# EAGLE schematic LiPo charger (EAGLE 7.7.0)
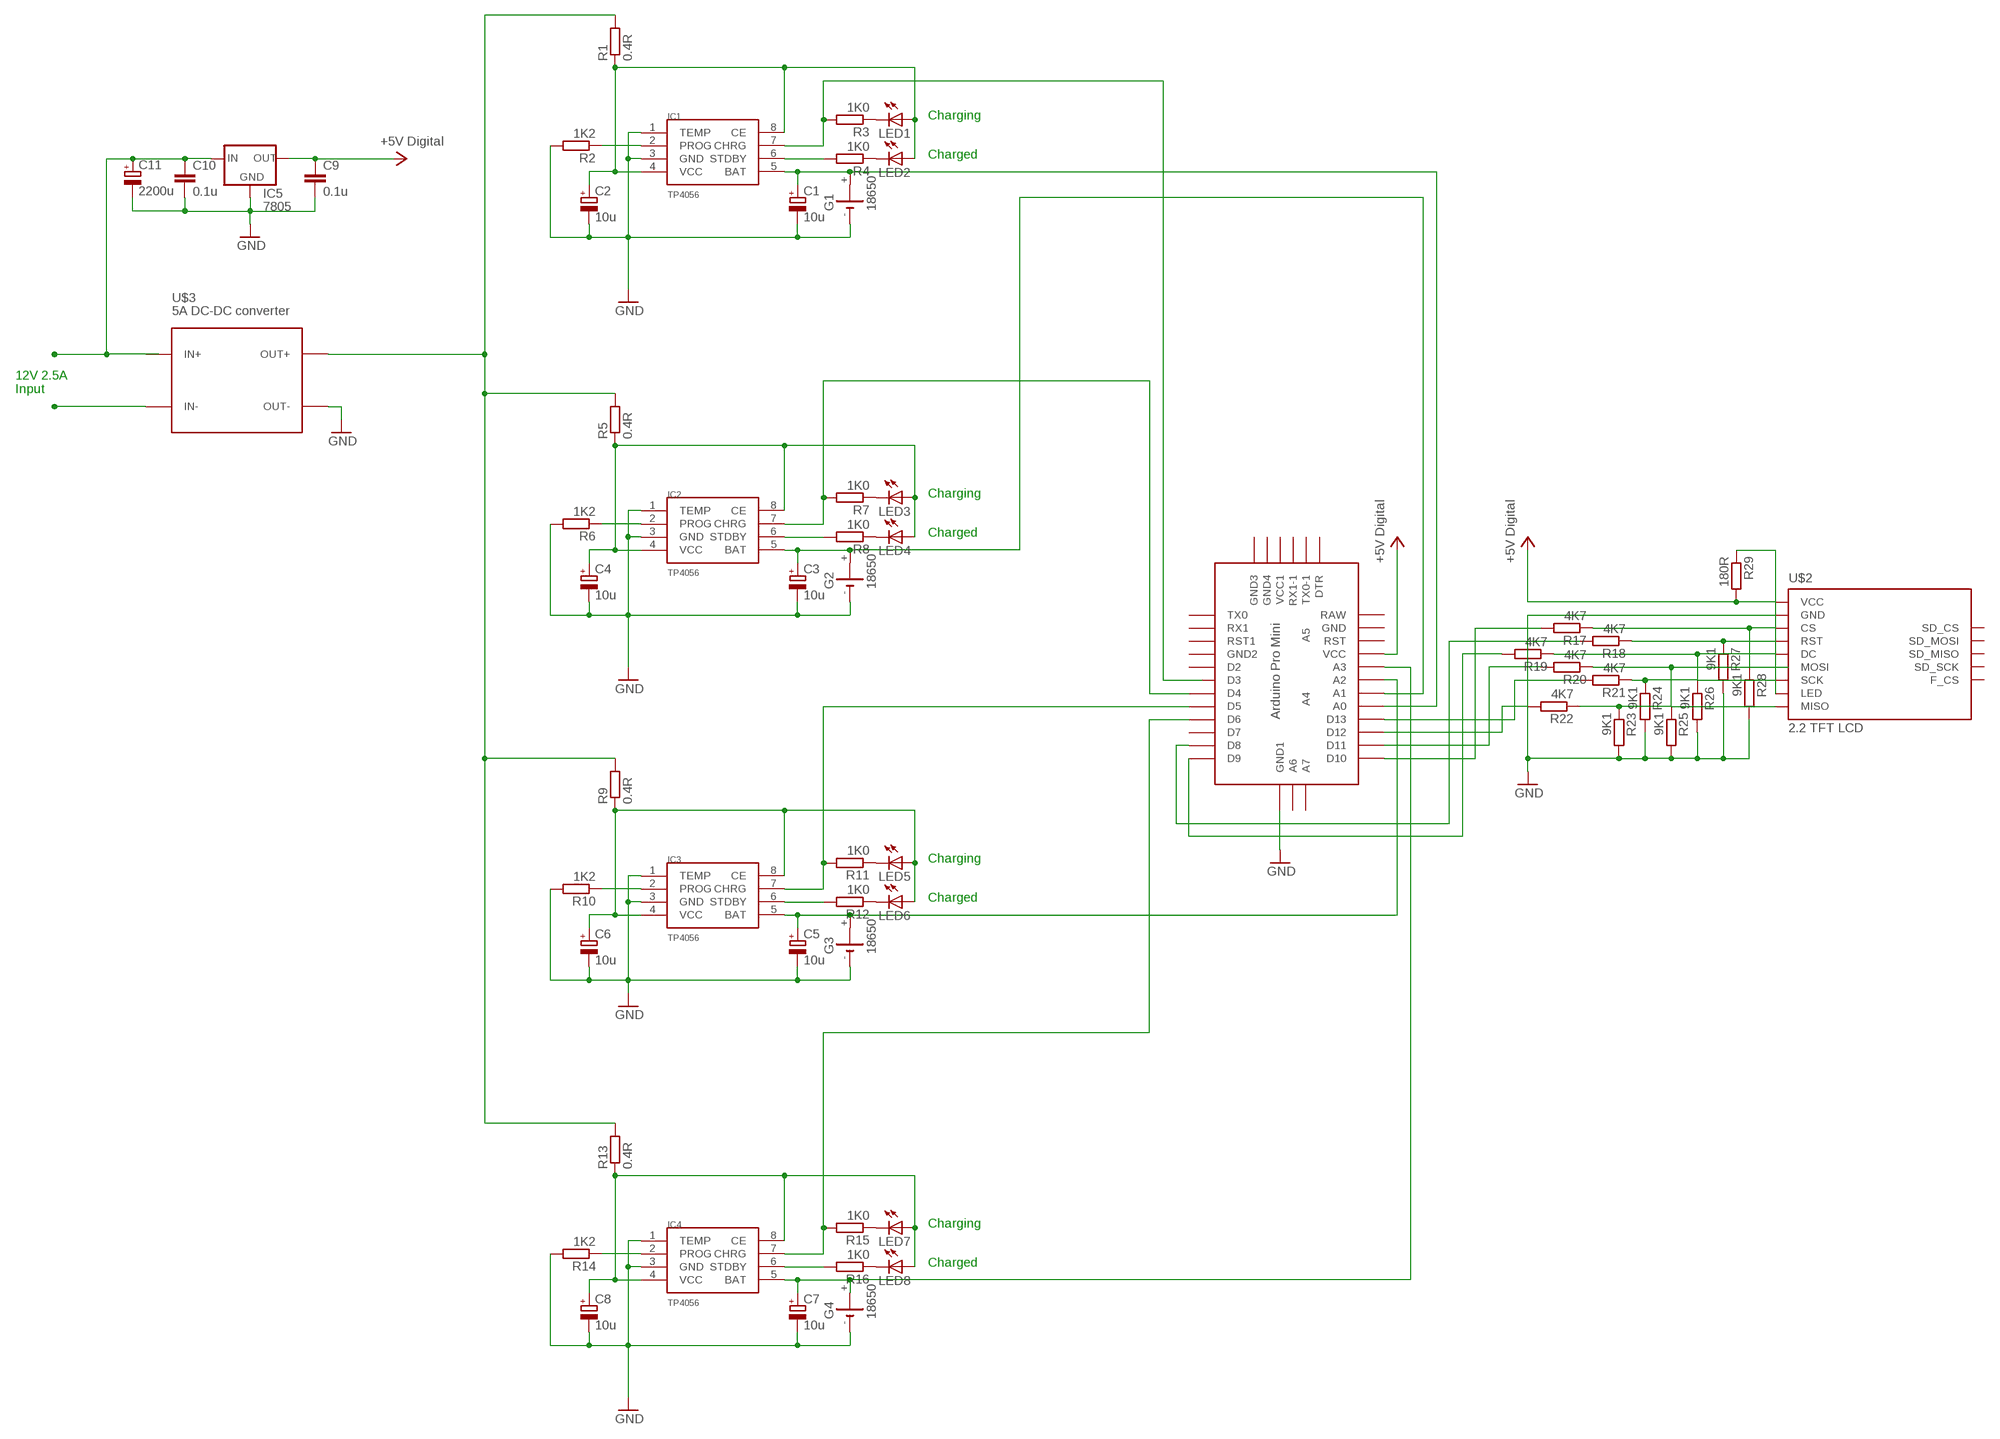
[diagram p0: schematic, sheet 1]

## Parts
C1  10u  CPOL-EU153CLV-1010  [153CLV-1010]
C2  10u  CPOL-EU153CLV-1010  [153CLV-1010]
C3  10u  CPOL-EU153CLV-1010  [153CLV-1010]
C4  10u  CPOL-EU153CLV-1010  [153CLV-1010]
C5  10u  CPOL-EU153CLV-1010  [153CLV-1010]
C6  10u  CPOL-EU153CLV-1010  [153CLV-1010]
C7  10u  CPOL-EU153CLV-1010  [153CLV-1010]
C8  10u  CPOL-EU153CLV-1010  [153CLV-1010]
C9  0.1u  C-EU050-025X075  [C050-025X075]
C10  0.1u  C-EU050-025X075  [C050-025X075]
C11  2200u  CPOL-EU153CLV-1010  [153CLV-1010]
G1  18650  CR2032V  [CR2032V]
G2  18650  CR2032V  [CR2032V]
G3  18650  CR2032V  [CR2032V]
G4  18650  CR2032V  [CR2032V]
IC1  TP4056  [SOP-8]
IC2  TP4056  [SOP-8]
IC3  TP4056  [SOP-8]
IC4  TP4056  [SOP-8]
IC5  7805  78XXL  [78XXL]
LED1  CREE-XLAMP-XM-L  [CREE-XLAMP-XM-L]
LED2  CREE-XLAMP-XM-L  [CREE-XLAMP-XM-L]
LED3  CREE-XLAMP-XM-L  [CREE-XLAMP-XM-L]
LED4  CREE-XLAMP-XM-L  [CREE-XLAMP-XM-L]
LED5  CREE-XLAMP-XM-L  [CREE-XLAMP-XM-L]
LED6  CREE-XLAMP-XM-L  [CREE-XLAMP-XM-L]
LED7  CREE-XLAMP-XM-L  [CREE-XLAMP-XM-L]
LED8  CREE-XLAMP-XM-L  [CREE-XLAMP-XM-L]
R1  0.4R  R-EU_0309/V  [0309V]
R2  1K2  R-EU_0309/V  [0309V]
R3  1K0  R-EU_0309/V  [0309V]
R4  1K0  R-EU_0309/V  [0309V]
R5  0.4R  R-EU_0309/V  [0309V]
R6  1K2  R-EU_0309/V  [0309V]
R7  1K0  R-EU_0309/V  [0309V]
R8  1K0  R-EU_0309/V  [0309V]
R9  0.4R  R-EU_0309/V  [0309V]
R10  1K2  R-EU_0309/V  [0309V]
R11  1K0  R-EU_0309/V  [0309V]
R12  1K0  R-EU_0309/V  [0309V]
R13  0.4R  R-EU_0309/V  [0309V]
R14  1K2  R-EU_0309/V  [0309V]
R15  1K0  R-EU_0309/V  [0309V]
R16  1K0  R-EU_0309/V  [0309V]
R17  4K7  R-EU_0309/V  [0309V]
R18  4K7  R-EU_0309/V  [0309V]
R19  4K7  R-EU_0309/V  [0309V]
R20  4K7  R-EU_0309/V  [0309V]
R21  4K7  R-EU_0309/V  [0309V]
R22  4K7  R-EU_0309/V  [0309V]
R23  9K1  R-EU_0309/V  [0309V]
R24  9K1  R-EU_0309/V  [0309V]
R25  9K1  R-EU_0309/V  [0309V]
R26  9K1  R-EU_0309/V  [0309V]
R27  9K1  R-EU_0309/V  [0309V]
R28  9K1  R-EU_0309/V  [0309V]
R29  180R  R-EU_0309/V  [0309V]
U$1  ABK-PRO-MINI  [ABK-PRO-MINI]
U$2  2.2_TFT_LCD  [2.2_TFT_LCD]
U$3  5A DC-DC converter  DC-DC-STEP-DOWN-LM2596  [DC-DC-STEP-DOWN-LM2596]

## Nets
+5V: C9.1 IC5.OUT ; supply symbol labelled +5V Digital
+5VDIGITAL: R29.2 U$1.VCC U$2.VCC ; supply symbol labelled +5V Digital
GND: C1.- C2.- C3.- C4.- C5.- C6.- C7.- C8.- C9.2 C10.2 C11.- G1.- G2.- G3.- G4.- IC1.1(TEMP) IC1.3(GND) IC2.1(TEMP) IC2.3(GND) IC3.1(TEMP) IC3.3(GND) IC4.1(TEMP) IC4.3(GND) IC5.GND R2.2 R6.2 R10.2 R14.2 R23.2 R24.2 R25.2 R26.2 R27.2 R28.2 U$1.GND4(GND1) U$2.GND U$3.OUT-
N$1: IC2.7(CHRG) R7.2 U$1.D4
N$2: IC1.7(CHRG) R3.2 U$1.D3
N$3: IC1.6(STDBY) R4.2
N$4: IC2.6(STDBY) R8.2
N$5: C2.+ IC1.4(VCC) IC1.8(CE) LED1.A LED1.A@1(A) LED2.A LED2.A@1(A) R1.1
N$6: LED1.C LED1.C@1(C) R3.1
N$7: IC1.2(PROG) R2.1
N$8: LED2.C LED2.C@1(C) R4.1
N$9: C1.+ G1.+ IC1.5(BAT) U$1.A0
N$10: C4.+ IC2.4(VCC) IC2.8(CE) LED3.A LED3.A@1(A) LED4.A LED4.A@1(A) R5.1
N$11: IC2.2(PROG) R6.1
N$12: LED3.C LED3.C@1(C) R7.1
N$13: LED4.C LED4.C@1(C) R8.1
N$14: C3.+ G2.+ IC2.5(BAT) U$1.A1
N$15: IC3.7(CHRG) R11.2 U$1.D5
N$16: IC3.6(STDBY) R12.2
N$17: C6.+ IC3.4(VCC) IC3.8(CE) LED5.A LED5.A@1(A) LED6.A LED6.A@1(A) R9.1
N$18: IC3.2(PROG) R10.1
N$19: LED5.C LED5.C@1(C) R11.1
N$20: LED6.C LED6.C@1(C) R12.1
N$21: C5.+ G3.+ IC3.5(BAT) U$1.A2
N$22: IC4.7(CHRG) R15.2 U$1.D6
N$23: IC4.6(STDBY) R16.2
N$24: C8.+ IC4.4(VCC) IC4.8(CE) LED7.A LED7.A@1(A) LED8.A LED8.A@1(A) R13.1
N$25: IC4.2(PROG) R14.1
N$26: LED7.C LED7.C@1(C) R15.1
N$27: LED8.C LED8.C@1(C) R16.1
N$28: C7.+ G4.+ G4.+@1(+) IC4.5(BAT) U$1.A3
N$29: R18.1 R27.1 U$2.RST
N$30: R21.2 U$1.D13
N$31: R22.2 U$1.D12
N$32: R20.2 U$1.D11
N$33: R17.2 U$1.D10
N$34: R19.2 U$1.D9
N$35: R18.2 U$1.D8
N$36: R17.1 R20.1 R22.1 R23.1 R25.1 R28.1 U$2.CS U$2.MISO U$2.MOSI
N$37: R19.1 R21.1 R24.1 R26.1 U$2.DC U$2.SCK
N$38: C10.1 C11.+ IC5.IN
N$39: U$3.IN-
N$40: R29.1 U$2.LED
N$41: R1.2 R5.2 R13.2 U$3.OUT+
N$44: R9.2
Unconnected: G1.+@1(+) G2.+@1(+) G3.+@1(+) U$1.A4 U$1.A5 U$1.A6 U$1.A7 U$1.D2 U$1.D7 U$1.DTR U$1.GND U$1.GND1(GND2) U$1.GND2(GND3) U$1.GND3(GND4) U$1.RAW U$1.RST U$1.RST1 U$1.RX1 U$1.RX1-1 U$1.TX0 U$1.TX0-1 U$1.VCC1 U$2.F_CS U$2.SD_CS U$2.SD_MISO U$2.SD_MOSI U$2.SD_SCK U$3.IN+

## Notes on the sheet
- Charging
- Charged
- 12V 2.5A
  Input
- Charging
- Charged
- Charging
- Charged
- Charging
- Charged

## Library data of the parts
C1-C8 C11 = resistor:CPOL-EU: POLARIZED CAPACITOR, European symbol
C9 C10 = resistor:C-EU: CAPACITOR, European symbol
G1-G4 = battery:CR2032V: LI BATTERY Varta
IC1-IC4 = TP4056:TP4056
IC5 = v-reg:78XXL: VOLTAGE REGULATOR
LED1-LED8 = led:CREE-XLAMP-XM-L: Cree® XLamp® XM-L LEDs Source: http://www.cree.com
R1-R29 = resistor:R-EU_: RESISTOR, European symbol
U$1 = Arduino-clone:ABK-PRO-MINI: ABK Pro-Mini Arduino Clone
U$2 = Aldar:2.2_TFT_LCD
U$3 = diy-modules:DC-DC-STEP-DOWN-LM2596: DC/DC Step-Down Regulator based on LM2596-ADJ chip LM2596 datasheet available here: http://www.ti.com/lit/ds/symlink/lm2596.pdf Click here to find device on ebay.com <http://www.ebay.com/sch/lm2596+power+regulator>